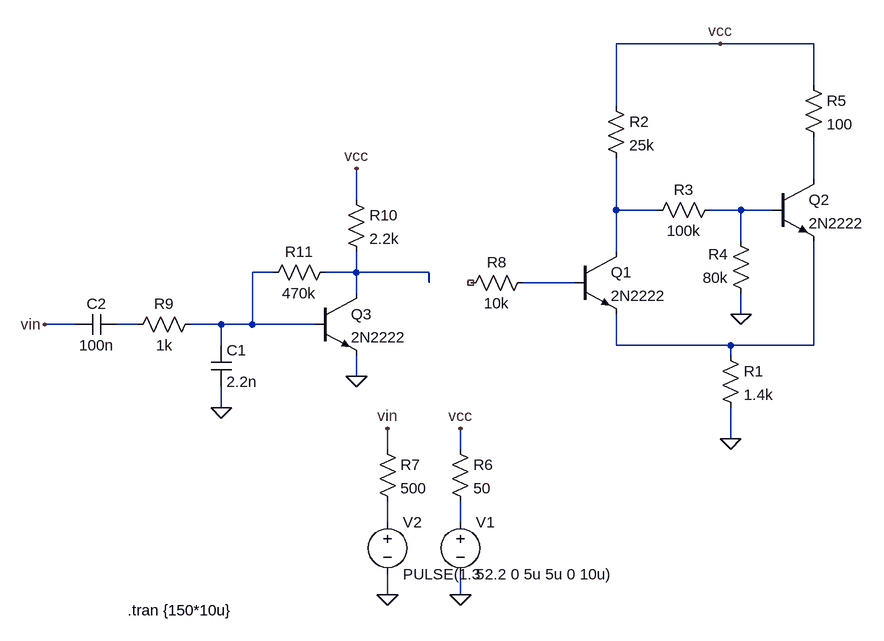
[diagram p0: schematic smith-trig-2.asc]
smith-trig-2.asc, the LTspice schematic file:
Version 4
SHEET 1 880 728
WIRE 336 -160 176 -160
WIRE 480 -160 336 -160
WIRE 480 -96 480 -160
WIRE 176 -64 176 -160
WIRE 480 48 480 -16
WIRE -224 80 -224 32
WIRE 176 96 176 16
WIRE 240 96 176 96
WIRE 368 96 320 96
WIRE 416 96 368 96
WIRE 368 144 368 96
WIRE 176 160 176 96
WIRE -352 192 -384 192
WIRE -224 192 -224 160
WIRE -224 192 -272 192
WIRE -112 192 -224 192
WIRE -112 208 -112 192
WIRE 112 208 32 208
WIRE -224 224 -224 192
WIRE 368 256 368 224
WIRE -656 272 -704 272
WIRE -560 272 -592 272
WIRE -432 272 -480 272
WIRE -384 272 -384 192
WIRE -384 272 -432 272
WIRE -288 272 -384 272
WIRE -432 304 -432 272
WIRE 176 304 176 256
WIRE 352 304 176 304
WIRE 480 304 480 144
WIRE 480 304 352 304
WIRE 352 320 352 304
WIRE -224 352 -224 320
WIRE -432 400 -432 368
WIRE 352 448 352 400
WIRE -176 464 -176 432
WIRE -64 464 -64 432
WIRE -176 576 -176 544
WIRE -64 576 -64 544
WIRE -176 688 -176 656
WIRE -64 688 -64 656
FLAG 352 448 0
FLAG 368 256 0
FLAG -64 688 0
FLAG -176 688 0
FLAG -64 432 vcc
FLAG 336 -160 vcc
FLAG -176 432 vin
FLAG -704 272 vin
FLAG -224 352 0
FLAG -224 32 vcc
FLAG -432 400 0
SYMBOL npn 112 160 R0
SYMATTR InstName Q1
SYMATTR Value 2N2222
SYMBOL npn 416 48 R0
SYMATTR InstName Q2
SYMATTR Value 2N2222
SYMBOL res 336 304 R0
SYMATTR InstName R1
SYMATTR Value 1.4k
SYMBOL res 160 -80 R0
SYMATTR InstName R2
SYMATTR Value 25k
SYMBOL res 336 80 R90
WINDOW 0 0 56 VBottom 2
WINDOW 3 32 56 VTop 2
SYMATTR InstName R3
SYMATTR Value 100k
SYMBOL res 384 240 R180
WINDOW 0 36 76 Left 2
WINDOW 3 36 40 Left 2
SYMATTR InstName R4
SYMATTR Value 80k
SYMBOL res 464 -112 R0
SYMATTR InstName R5
SYMATTR Value 100
SYMBOL voltage -64 560 R0
WINDOW 123 0 0 Left 0
WINDOW 39 0 0 Left 0
SYMATTR InstName V1
SYMATTR Value 5
SYMBOL res -80 448 R0
SYMATTR InstName R6
SYMATTR Value 50
SYMBOL voltage -176 560 R0
WINDOW 123 0 0 Left 0
WINDOW 39 0 0 Left 0
SYMATTR InstName V2
SYMATTR Value PULSE(1.3 2.2 0 5u 5u 0 10u)
SYMBOL res -192 448 R0
SYMATTR InstName R7
SYMATTR Value 500
SYMBOL npn -288 224 R0
SYMATTR InstName Q3
SYMATTR Value 2N2222
SYMBOL res -240 64 R0
SYMATTR InstName R10
SYMATTR Value 2.2k
SYMBOL res -256 176 R90
WINDOW 0 0 56 VBottom 2
WINDOW 3 32 56 VTop 2
SYMATTR InstName R11
SYMATTR Value 470k
SYMBOL cap -592 256 R90
WINDOW 0 0 32 VBottom 2
WINDOW 3 32 32 VTop 2
SYMATTR InstName C2
SYMATTR Value 100n
SYMBOL res 48 192 R90
WINDOW 0 0 56 VBottom 2
WINDOW 3 32 56 VTop 2
SYMATTR InstName R8
SYMATTR Value 10k
SYMBOL res -464 256 R90
WINDOW 0 0 56 VBottom 2
WINDOW 3 32 56 VTop 2
SYMATTR InstName R9
SYMATTR Value 1k
SYMBOL cap -448 304 R0
SYMATTR InstName C1
SYMATTR Value 2.2n
TEXT -576 712 Left 2 !.tran {150*10u}

The netlist it stands for:
* smith-trig-2.asc
Q1 N002 N006 N008 0 2N2222
Q2 N001 N003 N008 0 2N2222
R1 N008 0 1.4k
R2 vcc N002 25k
R3 N003 N002 100k
R4 0 N003 80k
R5 vcc N001 100
V1 N010 0 5
R6 vcc N010 50
V2 N009 0 PULSE(1.3 2.2 0 5u 5u 0 10u)
R7 vin N009 500
Q3 N005 N004 0 0 2N2222
R10 vcc N005 2.2k
R11 N005 N004 470k
C2 N007 vin 100n
R8 N006 NC_01 10k
R9 N004 N007 1k
C1 N004 0 2.2n
.model NPN NPN
.model PNP PNP
.lib standard.bjt
.tran {150*10u}
.backanno
.end